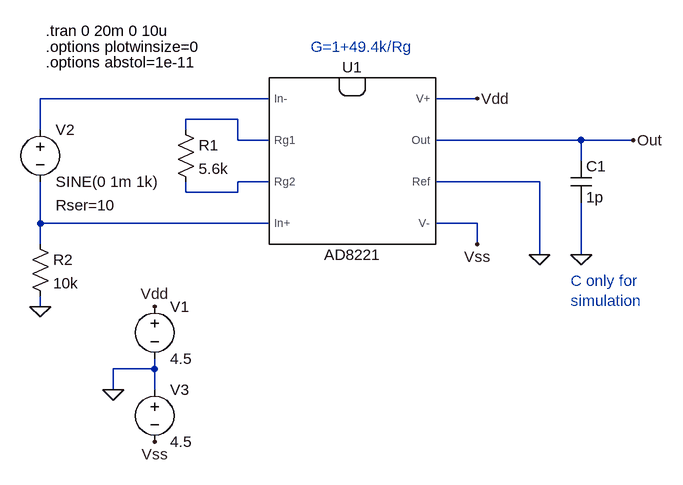
[diagram p0: schematic AD8221_test.asc]
AD8221_test.asc, the LTspice schematic file:
Version 4
SHEET 1 1304 804
WIRE 240 -16 -112 -16
WIRE 560 -16 496 -16
WIRE 192 16 112 16
WIRE -112 32 -112 -16
WIRE 112 32 112 16
WIRE 192 48 192 16
WIRE 240 48 192 48
WIRE 720 48 496 48
WIRE 800 48 720 48
WIRE 720 80 720 48
WIRE 240 112 192 112
WIRE 656 112 496 112
WIRE 112 128 112 112
WIRE 192 128 192 112
WIRE 192 128 112 128
WIRE -112 176 -112 112
WIRE 240 176 -112 176
WIRE 560 176 496 176
WIRE -112 208 -112 176
WIRE 560 208 560 176
WIRE 656 224 656 112
WIRE 720 224 720 144
WIRE -112 304 -112 288
WIRE 64 400 64 384
WIRE 64 400 0 400
WIRE 0 432 0 400
WIRE 64 432 64 400
FLAG 800 48 Out
FLAG 656 224 0
FLAG 64 304 Vdd
FLAG 64 512 Vss
FLAG 0 432 0
FLAG 560 -16 Vdd
FLAG 560 208 Vss
FLAG -112 304 0
FLAG 720 224 0
SYMBOL AD8221 368 80 R0
SYMATTR InstName U1
SYMBOL res 96 16 R0
SYMATTR InstName R1
SYMATTR Value 5.6k
SYMBOL voltage -112 16 R0
WINDOW 123 0 0 Left 0
WINDOW 39 24 132 Left 0
SYMATTR SpiceLine Rser=10
SYMATTR InstName V2
SYMATTR Value SINE(0 1m 1k)
SYMBOL voltage 64 288 R0
WINDOW 123 0 0 Left 0
WINDOW 39 0 0 Left 0
SYMATTR InstName V1
SYMATTR Value 4.5
SYMBOL voltage 64 416 R0
WINDOW 123 0 0 Left 0
WINDOW 39 0 0 Left 0
SYMATTR InstName V3
SYMATTR Value 4.5
SYMBOL res -128 192 R0
SYMATTR InstName R2
SYMATTR Value 10k
SYMBOL cap 704 80 R0
SYMATTR InstName C1
SYMATTR Value 1p
TEXT 304 -96 Left 0 ;G=1+49.4k/Rg
TEXT -104 -120 Left 0 !.tran 0 20m 0 10u
TEXT 704 264 Left 0 ;C only for \nsimulation
TEXT -104 -96 Left 0 !.options plotwinsize=0
TEXT -104 -72 Left 0 !.options abstol=1e-11

The netlist it stands for:
* AD8221_test.asc
XU1 N004 N001 Vdd Vss Out 0 N002 N003 AD8221  ; pins In+ In- V+ V- Out Ref Rg1 Rg2
R1 N002 N003 5.6k
V2 N001 N004 SINE(0 1m 1k) Rser=10
V1 Vdd 0 4.5
V3 0 Vss 4.5
R2 N004 0 10k
C1 Out 0 1p
* G=1+49.4k/Rg
.tran 0 20m 0 10u
* C only for
* simulation
.options plotwinsize=0
.options abstol=1e-11
.lib AD8221.cir
.backanno
.end